# EAGLE design Blinky (EAGLE 9.2.2)
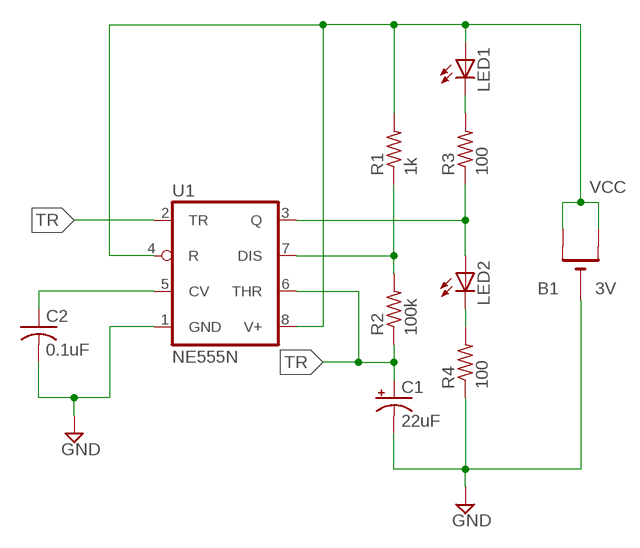
[diagram p0: schematic, sheet 1]

## Parts
B1  3V  CR1220THM  [CR1220-THM]
C1  22uF  CPOL-USE1.8-4  [E1,8-4]
C2  0.1uF  C-US025-025X050  [C025-025X050]
LED1  LED5MM  [LED5MM]
LED2  LED5MM  [LED5MM]
R1  1k  R-US_0309/12  [0309/12]
R2  100k  R-US_0309/12  [0309/12]
R3  100  R-US_0309/12  [0309/12]
R4  100  R-US_0309/12  [0309/12]
U1  NE555N  [DIL08]

## Nets
GND: B1.- C1.- C2.2 R4.1 U1.1(GND)
N$1: C2.1 U1.5(CV)
N$4: R1.1 R2.2 U1.7(DIS)
N$5: LED2.A R3.1 U1.3(Q)
N$6: LED2.K(C) R4.2
N$7: LED1.K(C) R3.2
TR: C1.+ R2.1 U1.2(TR) U1.6(THR)
VCC: B1.+1(+) B1.+2(+1) LED1.A R1.2 U1.4(R) U1.8(V+)

## Library data of the parts
B1 = adafruit:CR1220: CR1216/CR1220/CR1225 12mm 3V lithium coin cell Great for battery packup. Both SMT and THM holders. Note the THM package has the ground pads on both sides of the PCB so that the masks are the same - this reduces the cost; SPICEPREFIX: J
C1 = rcl:CPOL-US: POLARIZED CAPACITOR, American symbol; SPICEPREFIX: C
C2 = rcl:C-US: CAPACITOR, American symbol; SPICEPREFIX: C
LED1 LED2 = led:LED: LED OSRAM: - CHIPLED LG R971, LG N971, LY N971, LG Q971, LY Q971, LO R971, LY R971 LH N974, LH R974 LS Q976, LO Q976, LY Q976 LO Q996 - Hyper CHIPLED LW Q18S LB Q993, LB Q99A, LB R99A - SideLED LS A670, LO A670, LY A670, LG A670, LP A670 LB A673, LV A673, LT A673, LW A673 LH A674 LY A675 LS A676, LA A676, LO A676, LY A676, LW A676 LS A679, LY A679, LG A679 - Hyper Micro SIDELED® LS Y876, LA Y876, LO Y876, LY Y876 LT Y87S - SmartLED LW L88C, LW L88S LB L89C, LB L89S, LG L890 LS L89K, LO L89K, LY L89K LS L896, LA L896, LO L896, LY L896 - TOPLED LS T670, LO T670, LY T670, LG T670, LP T670 LSG T670, LSP T670, LSY T670, LOP T670, LYG T670 LG T671, LOG T671, LSG T671 LB T673, LV T673, LT T673, LW T673 LH T674 LS T676, LA T676, LO T676, LY T676, LB T676, LH T676, LSB T676, LW T676 LB T67C, LV T67C, LT T67C, LS T67K, LO T67K, LY T67K, LW E67C LS E67B, LA E67B, LO E67B, LY E67B, LB E67C, LV E67C, LT E67C LW T67C LS T679, LY T679, LG T679 LS T770, LO T770, LY T770, LG T770, LP T770 LB T773, LV T773, LT T773, LW T773 LH T774 LS E675, LA E675, LY E675, LS T675 LS T776, LA T776, LO T776, LY T776, LB T776 LHGB T686 LT T68C, LB T68C - Hyper Mini TOPLED® LB M676 - Mini TOPLED Santana® LG M470 LS M47K, LO M47K, LY M47K Source: http://www.osram.convergy.de LUXEON: - LUMILED® LXK2-PW12-R00, LXK2-PW12-S00, LXK2-PW14-U00, LXK2-PW14-V00 LXK2-PM12-R00, LXK2-PM12-S00, LXK2-PM14-U00 LXK2-PE12-Q00, LXK2-PE12-R00, LXK2-PE12-S00, LXK2-PE14-T00, LXK2-PE14-U00 LXK2-PB12-K00, LXK2-PB12-L00, LXK2-PB12-M00, LXK2-PB14-N00, LXK2-PB14-P00, LXK2-PB14-Q00 LXK2-PR12-L00, LXK2-PR12-M00, LXK2-PR14-Q00, LXK2-PR14-R00 LXK2-PD12-Q00, LXK2-PD12-R00, LXK2-PD12-S00 LXK2-PH12-R00, LXK2-PH12-S00 LXK2-PL12-P00, LXK2-PL12-Q00, LXK2-PL12-R00 Source: www.luxeon.com KINGBRIGHT: KA-3528ASYC Source: www.kingbright.com
R1-R4 = rcl:R-US_: RESISTOR, American symbol; SPICEPREFIX: R
U1 = linear:*555: TIMER; SPICEPREFIX: X

## Net classes
0 default: width 0.305 mm, drill 0.508 mm, clearance 0.508 mm

## Board
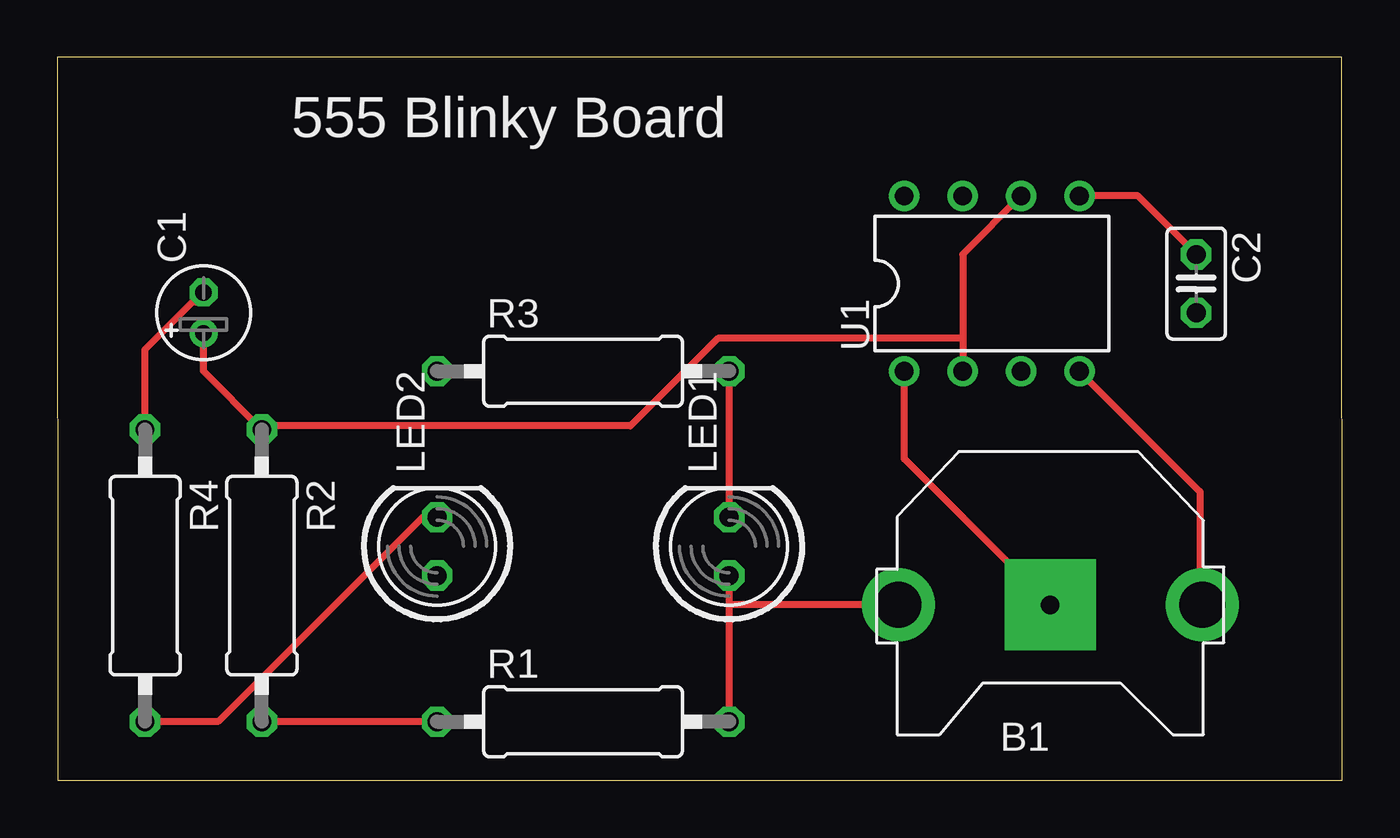
[diagram p1: board, top side]
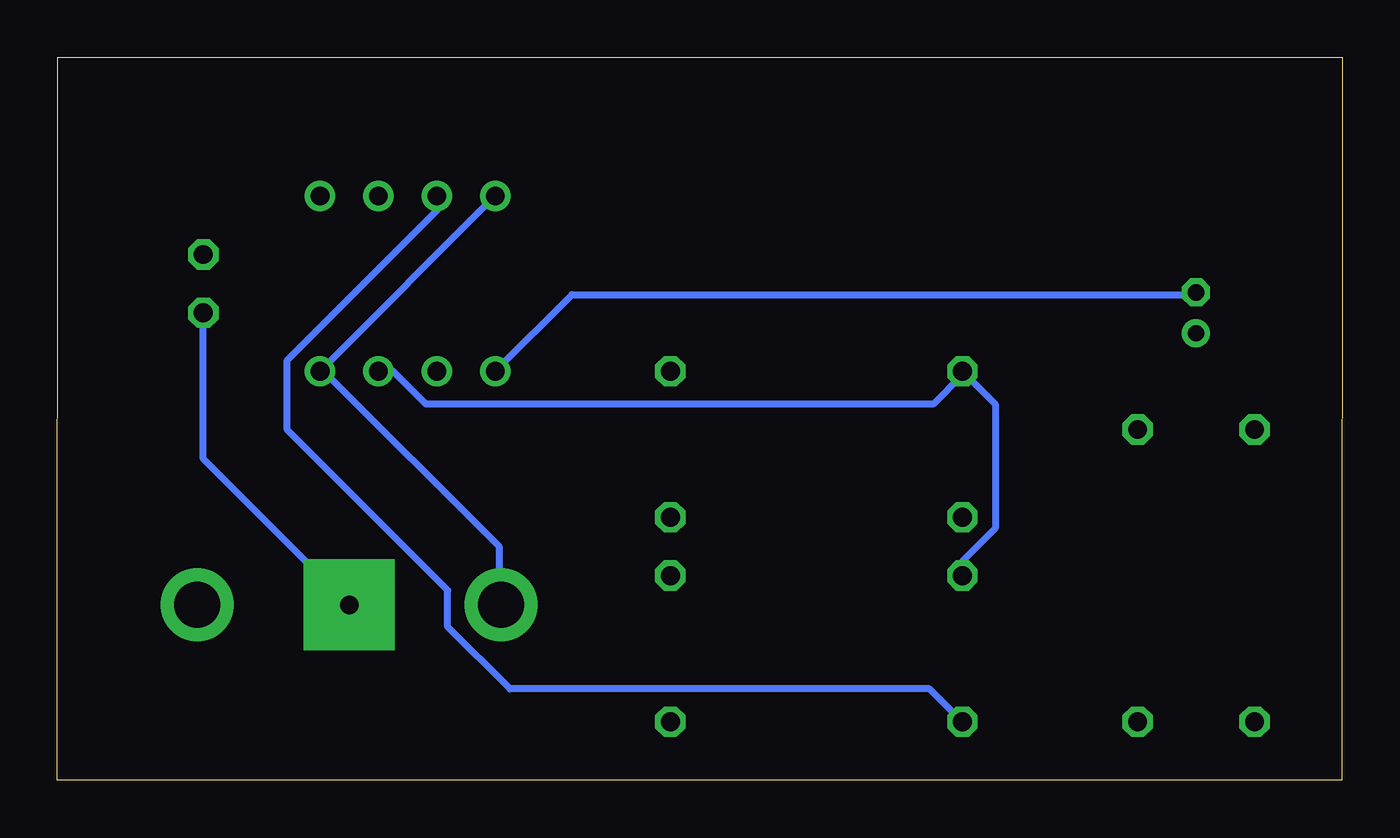
[diagram p2: board, bottom side, seen from below]

Size 55.87 x 31.42 mm. Coordinates in mm from the lower left corner, seen from the top.
Outline: 0.01,0 55.87,0 55.86,31.42 0,31.42 0.01,0
Copper layers (1*16): Top 0.035mm / dielectric 1.5mm / Bottom 0.035mm
Design rules "default": minimum track width 6mil, minimum drill 0.35mm, track to track 6mil, track to pad 6mil, pad to pad 6mil, via to via 6mil, smd to smd 6mil, copper to edge 40mil, drill to drill 6mil, minimum pad ring 10mil, minimum via ring 8mil, stop-mask expansion 4mil, vias tented up to drill 0mil, thermal gap 10mil

### Footprints (pad centres in the part's own frame; a part is rotated, then mirrored left to right if it is on the bottom)
CR1220-THM = drill 2 pad 3.175: +1 -6.604,0; +2 6.604,0 | drill 0.8 pad 3.962 square: - 0,0
E1,8-4 = drill 0.711 pad 1.168: + -0.889,0 | drill 0.711 pad 1.168 octagon: - 0.889,0
C025-025X050 = drill 0.813 octagon: 1 -1.27,0; 2 1.27,0
LED5MM = drill 0.813 octagon: A -1.27,0; K 1.27,0
0309/12 = drill 0.813 octagon: 1 -6.35,0; 2 6.35,0
DIL08 = drill 0.813 pad 1.27: 1 -3.81,-3.81; 2 -1.27,-3.81; 3 1.27,-3.81; 4 3.81,-3.81; 5 3.81,3.81; 6 1.27,3.81; 7 -1.27,3.81; 8 -3.81,3.81

### Placement (x,y rotation side)
B1  43.18,7.62 180 top
C1  6.35,20.32 90 top
C2  49.53,21.59 270 top
LED1  29.21,10.16 90 top
LED2  16.51,10.16 90 top
R1  22.86,2.54 0 top
R2  8.89,8.89 270 top
R3  22.86,17.78 0 top
R4  3.81,8.89 270 top
U1  40.64,21.59 0 top

### Tracks (layer width: path | path; a pad name or v marks a point on that pad's centre or on a via)
GND
  Top 0.305: R4.1 3.81,18.73 5.87,20.8 6.03,20.8 6.35,21.11 C1.- | U1.1 36.83,13.97 B1.-
  Bottom 0.305: C2.2 49.53,13.97 B1.- | U1.1 33.5,21.11 6.35,21.11 C1.-
N$1
  Top 0.305: U1.5 46.99,25.4 C2.1
N$4
  Top 0.305: R1.1 R2.2
  Bottom 0.305: U1.7 39.37,24.77 45.88,18.26 45.88,15.24 38.89,8.26 38.89,6.67 36.2,3.97 17.94,3.97 R1.1
N$5
  Bottom 0.305: LED2.A 16.51,9.53 15.08,10.95 15.08,16.35 R3.1 16.51,17.62 17.78,16.35 39.85,16.35 41.27,17.78 U1.3
N$6
  Top 0.305: R4.2 6.99,2.54 15.88,11.43 LED2.K
N$7
  Top 0.305: R3.2 LED1.K
TR
  Top 0.305: C1.+ 6.35,17.78 R2.1 8.89,15.4 24.92,15.4 28.73,19.21 39.37,19.21 | 39.37,19.21 39.37,22.86 U1.6 | 39.37,19.21 U1.2
VCC
  Top 0.305: LED1.A 29.21,7.62 | 29.21,7.62 R1.2 | B1.+2 29.21,7.62 | U1.4 49.69,12.54 49.69,7.62 B1.+1
  Bottom 0.305: U1.8 U1.4 44.29,17.78 36.67,10.16 36.67,7.62 B1.+2

### Text on the board
tNames: 555 Blinky Board